# Altium schematic sheet 005_PowerRele_OnOff.SchDoc
size A4; Organization: OLTEST; Revision: 01; SheetNumber: 5; SheetTotal: 12; Название листа: Название листа; Разработчик: Бондарчук С.; Прибор: R100; АМАК.000000.000 Э3: R100.220.040.000 Э3; Дата: 08.01.2018; Формат: A4
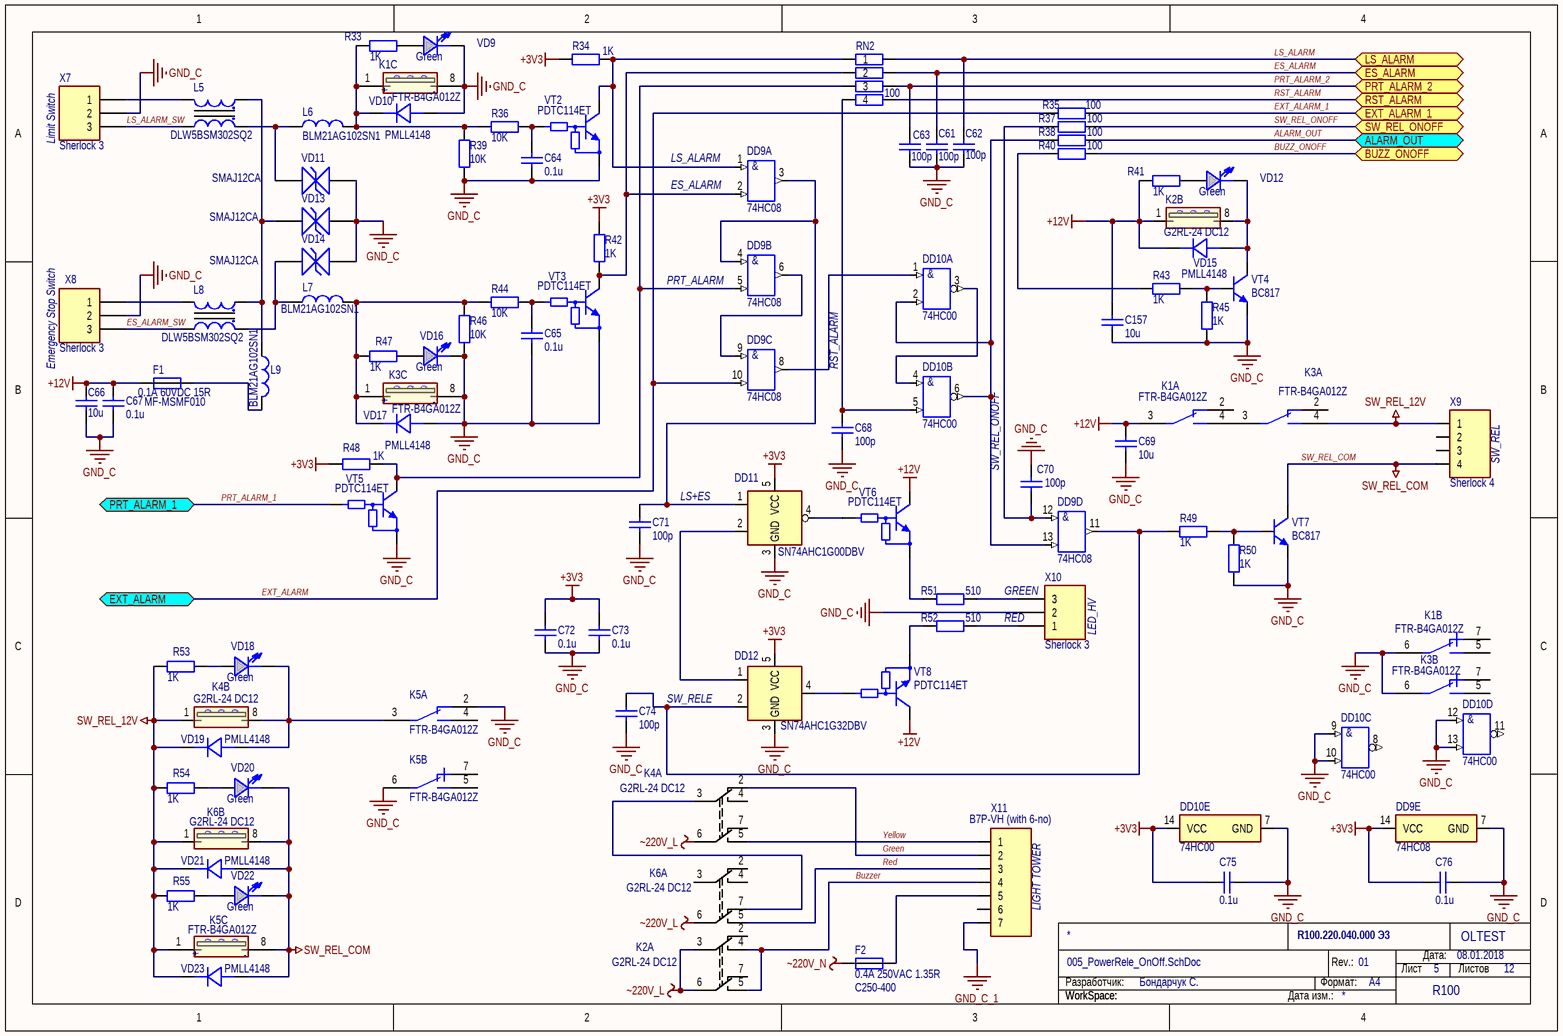
[diagram p0: 005_PowerRele_OnOff.SchDoc]

## Parts
C61  100p  [SMD_C_0603]
C62  100p  [SMD_C_0603]
C63  100p  [SMD_C_0603]
C64  0.1u  [SMD_C_0603]
C65  0.1u  [SMD_C_0603]
C66  10u  [SMD_C_1206]
C67  0.1u  [SMD_C_0603]
C68  100p  [SMD_C_0603]
C69  10u  [SMD_C_1206]
C70  100p  [SMD_C_0603]
C71  100p  [SMD_C_0603]
C72  0.1u  [SMD_C_0603]
C73  0.1u  [SMD_C_0603]
C74  100p  [SMD_C_0603]
C75  0.1u  [SMD_C_0603]
C76  0.1u  [SMD_C_0603]
C157  10u  [SMD_C_1206]
DD9  74HC08  [TSSOP14]  (parts A,B,C,D,E of 5)
DD10  74HC00  [TSSOP14]  (parts A,B,C,D,E of 5)
DD11  SN74AHC1G00DBV  [SOT-23(DBV)]
DD12  SN74AHC1G32DBV  [SOT-23(DBV)]
F1  0.1A 60VDC 15R  [MF-MSMF010]
F2  0.4A 250VAC 1.35R  [C250-400]
K1  FTR-B4GA012Z  [FTR-B4GA]  (parts A,B,C of 3)
K2  G2RL-24 DC12  [G2RL]  (parts A,B of 2)
K3  FTR-B4GA012Z  [FTR-B4GA]  (parts A,B,C of 3)
K4  G2RL-24 DC12  [G2RL]  (parts A,B of 2)
K5  FTR-B4GA012Z  [FTR-B4GA]  (parts A,B,C of 3)
K6  G2RL-24 DC12  [G2RL]  (parts A,B of 2)
L5  DLW5BSM302SQ2  [DLW5BS(AH)]
L6  BLM21AG102SN1  [SMD_L_L2_W1.25]
L7  BLM21AG102SN1  [SMD_L_L2_W1.25]
L8  DLW5BSM302SQ2  [DLW5BS(AH)]
L9  BLM21AG102SN1  [SMD_L_L2_W1.25]
R33  1K  [SMD_R_1206]
R34  1K  [SMD_R_0603]
R35  100  [SMD_R_0603]
R36  10K  [SMD_R_0603]
R37  100  [SMD_R_0603]
R38  100  [SMD_R_0603]
R39  10K  [SMD_R_0603]
R40  100  [SMD_R_0603]
R41  1K  [SMD_R_1206]
R42  1K  [SMD_R_0603]
R43  1K  [SMD_R_0805]
R44  10K  [SMD_R_0603]
R45  1K  [SMD_R_0805]
R46  10K  [SMD_R_0603]
R47  1K  [SMD_R_1206]
R48  1K  [SMD_R_0603]
R49  1K  [SMD_R_0805]
R50  1K  [SMD_R_0805]
R51  510  [SMD_R_1206]
R52  510  [SMD_R_1206]
R53  1K  [SMD_R_1206]
R54  1K  [SMD_R_1206]
R55  1K  [SMD_R_1206]
RN2  100  [CRA06S]
VD9  value Green  [SMD_LED_LL_Green]  (hidden comment: LL-S172GC-2A)
VD10  PMLL4148  [SOD80C]
VD11  SMAJ12CA  [DO-214AC noPolarity]
VD12  value Green  [SMD_LED_LL_Green]  (hidden comment: LL-S172GC-2A)
VD13  SMAJ12CA  [DO-214AC noPolarity]
VD14  SMAJ12CA  [DO-214AC noPolarity]
VD15  PMLL4148  [SOD80C]
VD16  value Green  [SMD_LED_LL_Green]  (hidden comment: LL-S172GC-2A)
VD17  PMLL4148  [SOD80C]
VD18  value Green  [SMD_LED_LL_Green]  (hidden comment: LL-S172GC-2A)
VD19  PMLL4148  [SOD80C]
VD20  value Green  [SMD_LED_LL_Green]  (hidden comment: LL-S172GC-2A)
VD21  PMLL4148  [SOD80C]
VD22  value Green  [SMD_LED_LL_Green]  (hidden comment: LL-S172GC-2A)
VD23  PMLL4148  [SOD80C]
VT2  PDTC114ET  [SOT23-3]
VT3  PDTC114ET  [SOT23-3]
VT4  BC817  [SOT23-3]
VT5  PDTC114ET  [SOT23-3]
VT6  PDTC114ET  [SOT23-3]
VT7  BC817  [SOT23-3]
VT8  PDTC114ET  [SOT23-3]
X7  Sherlock 3  [35362-0350]
X8  Sherlock 3  [35362-0350]
X9  Sherlock 4  [35362-0450]
X10  Sherlock 3  [35362-0350]
X11  B7P-VH (with 6-no)  [B7P-VH (WITH 6-no)]

## Ports
ALARM_OUT, BUZZ_ONOFF, ES_ALARM, EXT_ALARM, EXT_ALARM_1, LS_ALARM, PRT_ALARM_1, PRT_ALARM_2, RST_ALARM, SW_REL_ONOFF

## Nets
+3V3: C72.2 C73.2 C75.1 C76.1 DD9.14(VCC) DD10.14(VCC) DD11.5(VCC) DD12.5(VCC) R34.2 R42.2 R48.2
+12V: C66.2 C67.2 C69.2 C157.2 F1.1 K1.3 K2.1 R41.1 VD15.2(CATHODE) VT6.3(C) VT8.3(C)
GND_C: C61.1 C62.1 C63.1 C64.1 C65.1 C66.1 C67.1 C68.1 C69.1 C70.2 C71.1 C72.1 C73.1 C74.2 C75.2 C76.2 C157.1 DD9.7(GND) DD10.7(GND) DD10.9(3A) DD10.10(3B) DD10.12(4A) DD10.13(4B) DD11.3(GND) DD12.3(GND) K1.6 K1.8 K3.6 K3.8 K5.2 K5.6 R39.1 R45.1 R46.1 R50.1 VD9.2(CATHODE) VD10.1(ANODE) VD11.2 VD13.2 VD14.2 VD16.2(CATHODE) VD17.1(ANODE) VT2.2(E) VT3.2(E) VT4.2(E) VT5.2(E) VT7.2(E) X7.2 X8.2 X10.2
GND_C_1: X11.7
SW_REL_12V: K3.4 K4.1 K5.1 K6.1 R53.1 R54.1 R55.1 VD19.2(CATHODE) VD21.2(CATHODE) VD23.2(CATHODE) X9.1
SW_REL_COM: K5.8 K6.8 VD20.2(CATHODE) VD21.1(ANODE) VD22.2(CATHODE) VD23.1(ANODE) VT7.3(C) X9.4
~220V_L: K2.3 K2.6 K4.6 K6.6
~220V_N: F2.1
ALARM_OUT: R38.2 ; port ALARM_OUT
BUZZ_ONOFF: R40.2 ; port BUZZ_ONOFF
Buzzer: K2.4 K2.5 X11.4
ES_ALARM: C61.2 RN2.7 ; port ES_ALARM
ES_ALARM_SW: L8.3 X8.3
EXT_ALARM: DD9.10(3B) R35.1 ; port EXT_ALARM
EXT_ALARM_1: R35.2 ; port EXT_ALARM_1
Green: K4.2 X11.2
LS_ALARM: C62.2 RN2.8 ; port LS_ALARM
LS_ALARM_SW: L5.3 X7.3
PRT_ALARM_1: VT5.1(B) ; port PRT_ALARM_1
PRT_ALARM_2: C63.2 RN2.6 ; port PRT_ALARM_2
Red: K6.5 X11.3
RST_ALARM: RN2.5 ; port RST_ALARM
SW_REL_ONOFF: R37.2 ; port SW_REL_ONOFF
Yellow: K4.5 X11.1
NetC64_2: C64.2 R36.2 VT2.1(B)
NetC65_2: C65.2 R44.2 VT3.1(B)
NetC68_2: C68.2 DD10.5(2B) RN2.4
NetC70_1: C70.1 DD9.12(4A) R37.1
NetC71_2: C71.2 DD9.3(1Y) DD9.4(2A) DD11.1
NetC74_1: C74.1 DD9.11(4Y) DD12.2 R49.1
NetDD9_1: DD9.1(1A) R34.1 RN2.1 VT2.3(C)
NetDD9_2: DD9.2(1B) R42.1 RN2.2 VT3.3(C)
NetDD9_5: DD9.5(2B) R48.1 RN2.3 VT5.3(C)
NetDD9_6: DD9.6(2Y) DD9.9(3A)
NetDD9_8: DD9.8(3Y) DD10.1(1A)
NetDD9_13: DD9.13(4B) DD10.2(1B) DD10.6(2Y) R38.1
NetDD10_3: DD10.3(1Y) DD10.4(2A)
NetDD11_2: DD11.2 DD12.1
NetDD11_4: DD11.4 VT6.1(B)
NetDD12_4: DD12.4 VT8.1(B)
NetF1_2: F1.2 L9.2
NetF2_2: F2.2 X11.5
NetK1_1: K1.1 L6.2 R33.1 R36.1 R39.2 VD10.2(CATHODE)
NetK1_4: K1.4 K3.3
NetK2_8: K2.8 VD12.2(CATHODE) VD15.1(ANODE) VT4.3(C)
NetK3_1: K3.1 L7.2 R44.1 R46.2 R47.1 VD17.2(CATHODE)
NetK4_3: K4.3 K6.7
NetK4_8: K4.8 K5.3 VD18.2(CATHODE) VD19.1(ANODE)
NetL5_1: L5.1 L8.1 L9.1 VD13.1
NetL5_2: L5.2 X7.1
NetL5_4: L5.4 L6.1 VD11.1
NetL7_1: L7.1 L8.4 VD14.1
NetL8_2: L8.2 X8.1
NetR33_2: R33.2 VD9.1(ANODE)
NetR40_1: R40.1 R43.1
NetR41_2: R41.2 VD12.1(ANODE)
NetR43_2: R43.2 R45.2 VT4.1(B)
NetR47_2: R47.2 VD16.1(ANODE)
NetR49_2: R49.2 R50.2 VT7.1(B)
NetR51_1: R51.1 VT6.2(E)
NetR51_2: R51.2 X10.3
NetR52_1: R52.1 VT8.2(E)
NetR52_2: R52.2 X10.1
NetR53_2: R53.2 VD18.1(ANODE)
NetR54_2: R54.2 VD20.1(ANODE)
NetR55_2: R55.2 VD22.1(ANODE)

Not connected (* = marked no-connect by the designer): DD10 8(3Y) 11(4Y); K1 2 5 7; K2 2 7; K3 2 5 7; K4 4 7; K5 4 5 7; K6 2 3 4; X9 2 3; X11 6

## Notes on the sheet
- (near X7) Limit Switch
- (near DD9) LS_ALARM
- (near DD9) ES_ALARM
- (near DD9) PRT_ALARM
- Emergency Stop Switch
- RST_ALARM
- LS+ES
- SW_REL_ONOFF
- (near X9) SW_REL
- (near X10) GREEN
- (near X10) RED
- LED_HV
- SW_RELE
- (near X11) LIGHT TOWER
- Разработчик:
- Формат:
- Rev.:
- Лист
- Дата:
- Листов
- WorkSpace:
- Дата изм.:
- (in symbol 74HC00, part A) &
- (in symbol 74HC00, part B) &
- (in symbol 74HC00, part C) &
- (in symbol 74HC00, part D) &
- (in symbol 74HC08, part A) &
- (in symbol 74HC08, part B) &
- (in symbol 74HC08, part C) &
- (in symbol 74HC08, part D) &
- (in symbol FTR-B4GA012Z, part C) -; +
- (in symbol SN74AHC1G00DBV) &

## Library data of the parts
C61-C63 C68 C70 C71 C74 = C0603 100p 100V 5%: SMD C 0603 MURATA 100V 5% NP0; PartNumber: GRM1885C2A101JA01; Manufacturer: MURATA; Value: 100p
C64 C65 C67 C72 C73 C75 C76 = C0603 0.1u 50V 10%: SMD C 0603 MURATA 50V 10% X7R; PartNumber: GRM188R71H104K; Manufacturer: MURATA; Value: 0.1u
C66 C69 C157 = C1206 10u 25V 20%: SMD C 1206 MURATA 25V 20% X5R; PartNumber: GRM31MR61E106M; Manufacturer: MURATA; Value: 10u
DD9 = 74HC08: Quad 2-Input Positive-NAND Gates, PW0014A; Generic Part Number: SN74HC00; Manufacturer: Texas Instruments; PartNumber: SN74HC08PW; VCC(Min)(V): 2; VCC(Max)(V): 6; Output Type: CMOS; ICC @ Nom Voltage(Max)(mA): 0.02; Bits(#): 4; F @ Nom Voltage(Max)(Mhz): 70; Technology Family: HC; Voltage(Nom)(V): 5; Schmitt Trigger: Yes; Output Drive (IOL/IOH)(Max)(mA): 5.2/-5.2; tpd @ Nom Voltage(Max)(ns): 23; PackageReference: PW0014A; Input Type: CMOS; Operating Temperature Range(C): -40 to 85
DD10 = 74HC00: Quad 2-Input Positive-NAND Gates, PW0014A; Generic Part Number: SN74HC00; Manufacturer: Texas Instruments; PartNumber: SN74HC00PW; VCC(Min)(V): 2; VCC(Max)(V): 6; Output Type: CMOS; ICC @ Nom Voltage(Max)(mA): 0.02; Bits(#): 4; F @ Nom Voltage(Max)(Mhz): 70; Technology Family: HC; Voltage(Nom)(V): 5; Schmitt Trigger: Yes; Output Drive (IOL/IOH)(Max)(mA): 5.2/-5.2; tpd @ Nom Voltage(Max)(ns): 23; PackageReference: PW0014A; Input Type: CMOS; Operating Temperature Range(C): -40 to 85
DD11 = SN74AHC1G00DBV: 2-in NAND; Manufacturer: Texas Instruments; PartNumber: SN74AHC1G00DBV
DD12 = SN74AHC1G32DBV: 2-in OR; Manufacturer: Texas Instruments; PartNumber: SN74AHC1G32DBV
F1 = MF-MSMF010 (0.1A 60VDC 15R): PTC Resettable Fusses 0.1A 60VDC 15R; Manufacturer: BOURNS; PartNumber: MF-MSMF010
F2 = C250-400 (0.4A 250VAC 1.35R): PTC Resettable Fusses 0.4A 250VAC 1.35R; Manufacturer: SEA&LAND ELECTRONIC CORP.; PartNumber: C250-400
K1 K3 K5 = FTR-B4GA012Z: 250VAC 1A DPDT 12VDC; Manufacturer: Fujitsu; PartNumber: FTR-B4GA012Z
K2 K4 K6 = G2RL-24 DC12: 440VAC 8A DPDT 12VDC; Manufacturer: Omron; PartNumber: G2RL-24 DC12
L5 L8 = DLW5BSM302SQ2: SMD Common Mode Choke Coil 0.5A Z = 3000 Ohm / 100 MHz; Manufacturer: MURATA; PartNumber: DLW5BSM302SQ2
L6 L7 L9 = BLM21AG102SN1: 1000R 0.6A (100MHz); Manufacturer: TDK; Value: 1000R 0.6A (100MHz); PartNumber: BLM21AG102SN1
R33 R41 R47 R53-R55 = R1206 1K 1%: SMD R 1206 VISHAY 0.25W 200V 1% 100ppm; PartNumber: CRCW12061K00FK; Manufacturer: VISHAY; Value: 1K
R34 R42 R48 = R0603 1K 1%: SMD R 0603 VISHAY 0.1W 75V 1% 100ppm; PartNumber: CRCW06031K00FK; Manufacturer: VISHAY; Value: 1K
R35 R37 R38 R40 = R0603 100 1%: SMD R 0603 VISHAY 0.1W 75V 1% 100ppm; PartNumber: CRCW0603100RFK; Manufacturer: VISHAY; Value: 100
R36 R39 R44 R46 = R0603 10К 1%: SMD R 0603 VISHAY 0.1W 75V 1% 100ppm; PartNumber: CRCW060310K0FK; Manufacturer: VISHAY; Value: 10K
R43 R45 R49 R50 = R0805 1K 1%: SMD R 0805 VISHAY 0.125W 150V 1% 100ppm; PartNumber: CRCW08051K00FK; Manufacturer: VISHAY; Value: 1K
R51 R52 = R1206 510 1%: SMD R 1206 VISHAY 0.25W 200V 1% 100ppm; PartNumber: CRCW1206510RFK; Manufacturer: VISHAY; Value: 510
RN2 = CRA06S 4x100 1%: SMD RESISTOR ARRAY VISHAY 0.063W 50V 1% 100ppm; PartNumber: CRA06S083100RF; Manufacturer: VISHAY; Value: 100
VD9 VD12 VD16 VD18 VD20 VD22 = LL-S172GC-2A: LED Green SMD; Manufacturer: Lucky Light; PartNumber: LL-S172GC-2A
VD10 VD15 VD17 VD19 VD21 VD23 = PMLL4148: If=0.2A, Vf=1V Vrrm=100V Diode (SOD80C); Manufacturer: NXP Semiconductors; PartNumber: PMLL4148
VD11 VD13 VD14 = SMAJ12CA: 400W 12V  Transient Voltage Suppressor, Bidirectional; Manufacturer: LITTELFUSE; PartNumber: SMAJ12CA
VT2 VT3 VT5 VT6 VT8 = PDTC114ET: Digital Transistor (BRT), R1=10 kOhm, R2=10 kOhm, NPN Transistor; Manufacturer: On Semiconductor; PartNumber: PDTC114ET
VT4 VT7 = BC817: NPN Silicon, 3-Pin SOT-23; Manufacturer: NXP; PartNumber: BC817
X7 X8 X10 = 35362-0350: Sherlock 3 Top, 2A 125V 2mm; Manufacturer: MOLEX; PartNumber: 35362-0350
X9 = 35362-0450: Sherlock 4 Top, 2A 125V 2mm; Manufacturer: MOLEX; PartNumber: 35362-0450
X11 = B7P-VH (WITH 6-no): VH 7 конт LS=3.96 10A 250V PCB; Manufacturer: JST; PartNumber: B7P-VH